# Altium schematic sheet bat_connectors.SchDoc
size A3; DocumentNumber: 14; SheetNumber: 14; SheetTotal: 15; SheetDescription: Connection to pack
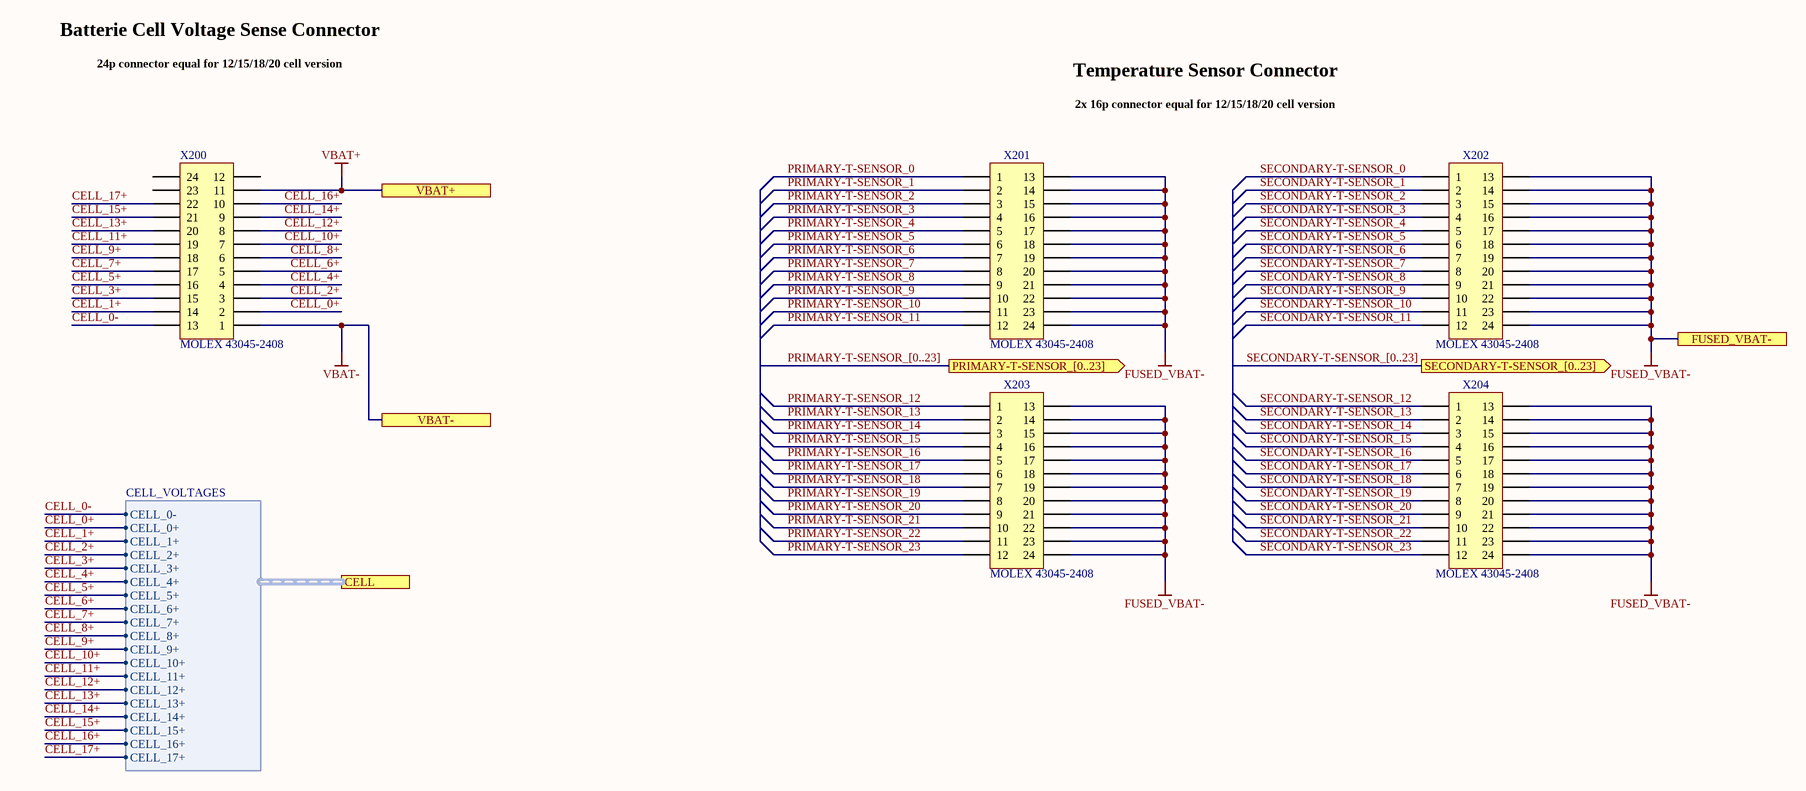
[diagram p0: bat_connectors.SchDoc]

## Parts
X200  MOLEX 43045-2408  [MOLEX 43045-2408]
X201  MOLEX 43045-2408  [MOLEX 43045-2408]
X202  MOLEX 43045-2408  [MOLEX 43045-2408]
X203  MOLEX 43045-2408  [MOLEX 43045-2408]
X204  MOLEX 43045-2408  [MOLEX 43045-2408]

## Ports
CELL (harness CELL_VOLTAGES), FUSED_VBAT-, PRIMARY-T-SENSOR_[0..23] (out), SECONDARY-T-SENSOR_[0..23] (out), VBAT+, VBAT-

## Harnesses
CELL_VOLTAGES: CELL_0-, CELL_0+, CELL_1+, CELL_2+, CELL_3+, CELL_4+, CELL_5+, CELL_6+, CELL_7+, CELL_8+, CELL_9+, CELL_10+, CELL_11+, CELL_12+, CELL_13+, CELL_14+, CELL_15+, CELL_16+, CELL_17+

## Nets
FUSED_VBAT-: X201.13 X201.14 X201.15 X201.16 X201.17 X201.18 X201.19 X201.20 X201.21 X201.22 X201.23 X201.24 X202.13 X202.14 X202.15 X202.16 X202.17 X202.18 X202.19 X202.20 X202.21 X202.22 X202.23 X202.24 X203.13 X203.14 X203.15 X203.16 X203.17 X203.18 X203.19 X203.20 X203.21 X203.22 X203.23 X203.24 X204.13 X204.14 X204.15 X204.16 X204.17 X204.18 X204.19 X204.20 X204.21 X204.22 X204.23 X204.24 ; port FUSED_VBAT-
VBAT+: X200.11 ; port VBAT+
VBAT-: X200.1 ; port VBAT-
CELL_0+: X200.2 ; port CELL.CELL_0+
CELL_0-: X200.13 ; port CELL.CELL_0-
CELL_1+: X200.14 ; port CELL.CELL_1+
CELL_2+: X200.3 ; port CELL.CELL_2+
CELL_3+: X200.15 ; port CELL.CELL_3+
CELL_4+: X200.4 ; port CELL.CELL_4+
CELL_5+: X200.16 ; port CELL.CELL_5+
CELL_6+: X200.5 ; port CELL.CELL_6+
CELL_7+: X200.17 ; port CELL.CELL_7+
CELL_8+: X200.6 ; port CELL.CELL_8+
CELL_9+: X200.18 ; port CELL.CELL_9+
CELL_10+: X200.7 ; port CELL.CELL_10+
CELL_11+: X200.19 ; port CELL.CELL_11+
CELL_12+: X200.8 ; port CELL.CELL_12+
CELL_13+: X200.20 ; port CELL.CELL_13+
CELL_14+: X200.9 ; port CELL.CELL_14+
CELL_15+: X200.21 ; port CELL.CELL_15+
CELL_16+: X200.10 ; port CELL.CELL_16+
CELL_17+: X200.22 ; port CELL.CELL_17+
PRIMARY-T-SENSOR_0: X201.1
PRIMARY-T-SENSOR_1: X201.2
PRIMARY-T-SENSOR_2: X201.3
PRIMARY-T-SENSOR_3: X201.4
PRIMARY-T-SENSOR_4: X201.5
PRIMARY-T-SENSOR_5: X201.6
PRIMARY-T-SENSOR_6: X201.7
PRIMARY-T-SENSOR_7: X201.8
PRIMARY-T-SENSOR_8: X201.9
PRIMARY-T-SENSOR_9: X201.10
PRIMARY-T-SENSOR_10: X201.11
PRIMARY-T-SENSOR_11: X201.12
PRIMARY-T-SENSOR_12: X203.1
PRIMARY-T-SENSOR_13: X203.2
PRIMARY-T-SENSOR_14: X203.3
PRIMARY-T-SENSOR_15: X203.4
PRIMARY-T-SENSOR_16: X203.5
PRIMARY-T-SENSOR_17: X203.6
PRIMARY-T-SENSOR_18: X203.7
PRIMARY-T-SENSOR_19: X203.8
PRIMARY-T-SENSOR_20: X203.9
PRIMARY-T-SENSOR_21: X203.10
PRIMARY-T-SENSOR_22: X203.11
PRIMARY-T-SENSOR_23: X203.12
SECONDARY-T-SENSOR_0: X202.1
SECONDARY-T-SENSOR_1: X202.2
SECONDARY-T-SENSOR_2: X202.3
SECONDARY-T-SENSOR_3: X202.4
SECONDARY-T-SENSOR_4: X202.5
SECONDARY-T-SENSOR_5: X202.6
SECONDARY-T-SENSOR_6: X202.7
SECONDARY-T-SENSOR_7: X202.8
SECONDARY-T-SENSOR_8: X202.9
SECONDARY-T-SENSOR_9: X202.10
SECONDARY-T-SENSOR_10: X202.11
SECONDARY-T-SENSOR_11: X202.12
SECONDARY-T-SENSOR_12: X204.1
SECONDARY-T-SENSOR_13: X204.2
SECONDARY-T-SENSOR_14: X204.3
SECONDARY-T-SENSOR_15: X204.4
SECONDARY-T-SENSOR_16: X204.5
SECONDARY-T-SENSOR_17: X204.6
SECONDARY-T-SENSOR_18: X204.7
SECONDARY-T-SENSOR_19: X204.8
SECONDARY-T-SENSOR_20: X204.9
SECONDARY-T-SENSOR_21: X204.10
SECONDARY-T-SENSOR_22: X204.11
SECONDARY-T-SENSOR_23: X204.12

Not connected (* = marked no-connect by the designer): X200 12 23 24

## Buses and harness runs
bus PRIMARY-T-SENSOR_[0..23] = port PRIMARY-T-SENSOR_[0..23]
bus SECONDARY-T-SENSOR_[0..23] = port SECONDARY-T-SENSOR_[0..23]

## Notes on the sheet
- Batterie Cell Voltage Sense Connector
- 24p connector equal for 12/15/18/20 cell version
- Temperature Sensor Connector
- 2x 16p connector equal for 12/15/18/20 cell version
- Fraunhofer IISB
- Schottkystraße 10
- 91058 Erlangen, Germany
- Author
- Project
- License
- File
- Description
- Version
- Release Date
- Sheet
- Status
- www.iisb.fraunhofer.de
- /

## Library data of the parts
X200-X204 = MOLEX 43045-2408: Micro-Fit 3.0 Right-Angle Header, 3.00mm Pitch, Dual Row, 24 Circuits